# EAGLE design mlrs_lora_e5mini (EAGLE 9.6.2)
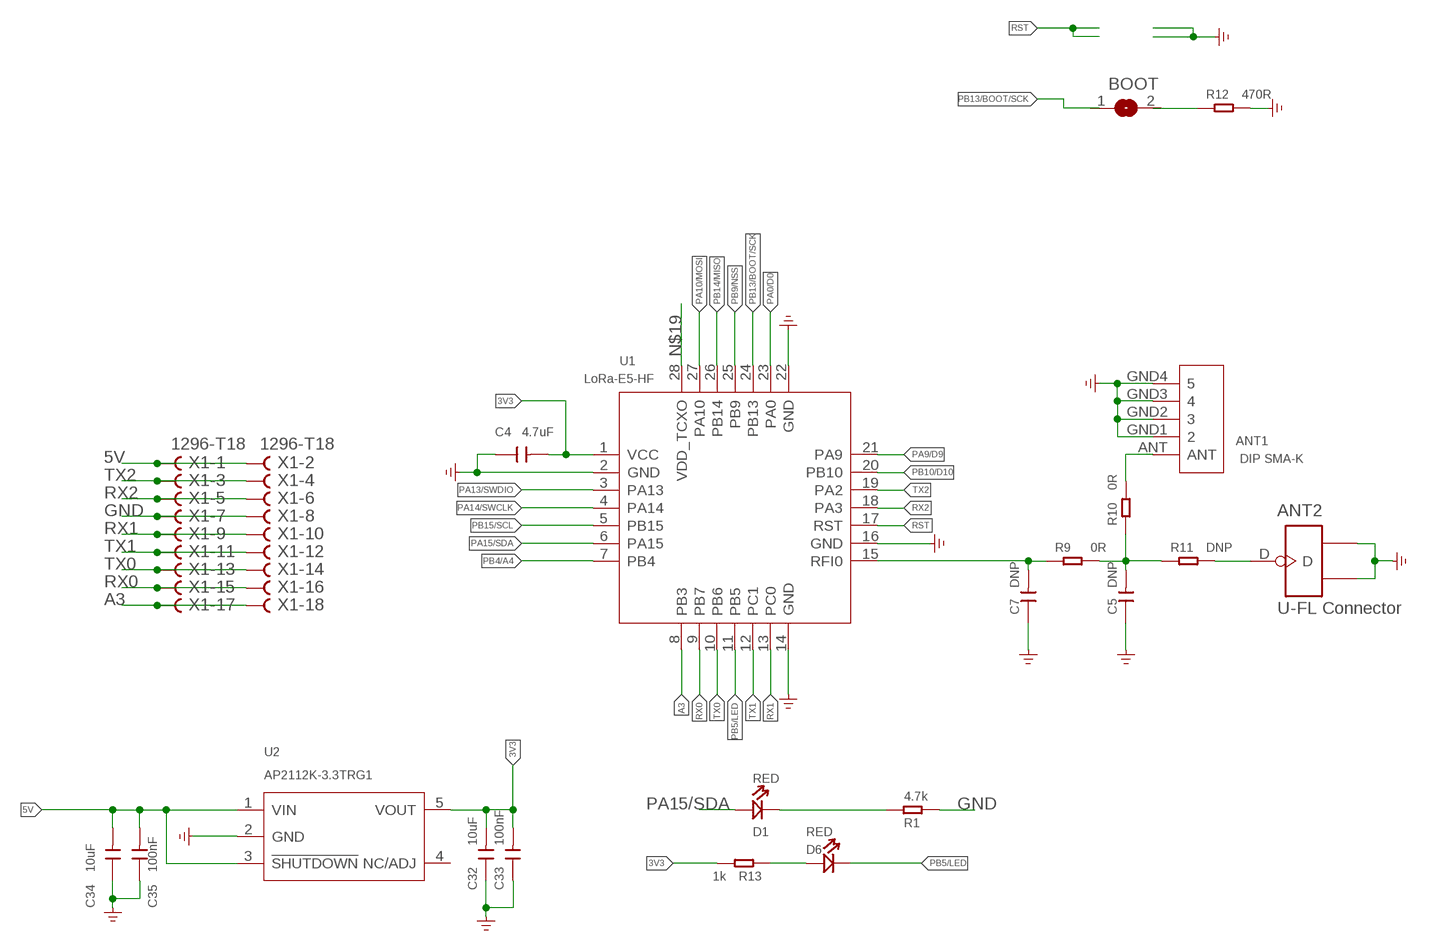
[diagram p0: schematic, sheet 1]

## Parts
ANT1  DIP SMA-K  ANTENNA-SMA-MCX-JE-320160125  [SMA5P-SMD-5.1-6.5X6.5X16.5MM]
ANT2  U-FL Connector  ANTENNA-U-FL-320110048  [U-FL3P-SMD-2.6X2.6X1.0MM]
BOOT  SJ  [SJ]
C4  4.7uF  CAP-0603  [C0603]
C5  DNP  CAP-0402  [C0402]
C7  DNP  CAP-0402  [C0402]
C32  10uF  CAP-0805  [C0805]
C33  100nF  CAP-0603  [C0603]
C34  10uF  CAP-0805  [C0805]
C35  100nF  CAP-0603  [C0603]
D1  RED  LED'0603'  [LED-0603]
D6  RED  LED'0603'  [LED-0603]
R1  4.7k  RES-0402  [R0402]
R9  0R  RES-0402  [R0402]
R10  0R  RES-0402  [R0402]
R11  DNP  RES-0402  [R0402]
R12  470R  RES-0402  [R0402]
R13  1k  RES-0402  [R0402]
U1  LoRa-E5-HF  MOUDLE_LORA_E5  [MOUDLE28P-1.25-12X12X2.5MM]
U2  AP2112K-3.3TRG1  PMIC-AP2127  [SOT-23-5]
X1  1296-T18  [1296-18]

## Nets
3V3: C4.2 C32.2 C33.2 R13.2 U1.1(VCC) U2.5(VOUT)
5V: C34.2 C35.2 U2.1(VIN) U2.3(!SHUTDOWN) X1.1 X1.2
A3: U1.8(PB3) X1.17 X1.18
GND: ANT1.GND1 ANT1.GND2 ANT1.GND3 ANT1.GND4 ANT2.GND1 ANT2.GND2 C4.1 C5.1 C7.1 C32.1 C33.1 C34.1 C35.1 R1.2 R12.2 U1.2(GND) U1.14(GND) U1.16(GND) U1.22(GND) U2.2(GND) X1.7 X1.8 ; supply symbol labelled GND_POWER
N$1: D1.- R1.1
N$4: ANT2.D R11.2
N$12: D6.+ R13.1
N$13: ANT1.ANT R10.2
N$19: U1.28(VDD_TCXO)
N$28: C5.2 R9.2 R10.1 R11.1
N$29: BOOT.2 R12.1
PA0/D0: U1.23(PA0)
PA9/D9: U1.21(PA9)
PA10/MOSI: U1.27(PA10)
PA13/SWDIO: U1.3(PA13)
PA14/SWCLK: U1.4(PA14)
PA15/SDA: D1.+ U1.6(PA15)
PB4/A4: U1.7(PB4)
PB5/LED: D6.- U1.11(PB5)
PB9/NSS: U1.25(PB9)
PB10/D10: U1.20(PB10)
PB13/BOOT/SCK: BOOT.1 U1.24(PB13)
PB14/MISO: U1.26(PB14)
PB15/SCL: U1.5(PB15)
RF: C7.2 R9.1 U1.15(RFI0)
RST: U1.17(RST)
RX0: U1.9(PB7) X1.15 X1.16
RX1: U1.13(PC0) X1.9 X1.10
RX2: U1.18(PA3) X1.5 X1.6
TX0: U1.10(PB6) X1.13 X1.14
TX1: U1.12(PC1) X1.11 X1.12
TX2: U1.19(PA2) X1.3 X1.4
Unconnected: U2.4(NC/ADJ)

## Library data of the parts
ANT1 = Connector-new:ANTENNA-SMA-MCX-JE
ANT2 = Connector-new:ANTENNA-U-FL
BOOT = jumper:SJ: SMD solder JUMPER
C4 C5 C7 C32-C35 = Discrete-new:CAP: Ceramic Capacitors
D1 D6 = Discrete-new:LED
R1 R9-R13 = Discrete-new:RES
U1 = moudle-new:MOUDLE_LORA_E5
U2 = PMIC:PMIC-AP2127
X1 = con-leotronics:1296-T18: 1.27mm SINGLE ROW FEMALE SOCKET Source: http://www.leotronics.co.uk/Conexcon/Data%20Sheets/sec.%20A/1296ing.pdf; OC_FARNELL: unknown; OC_NEWARK: unknown

## Board
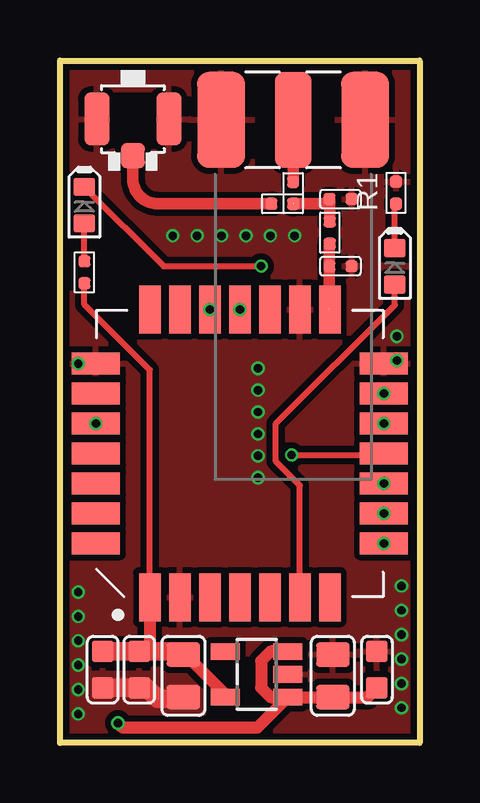
[diagram p1: board, top side]
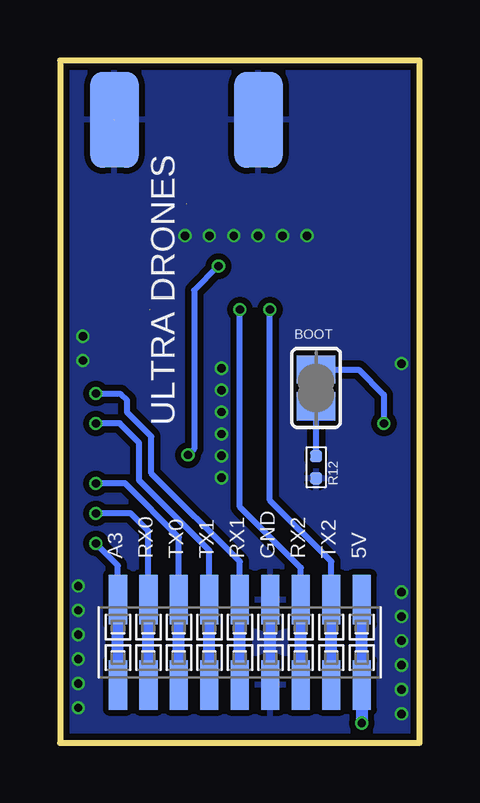
[diagram p2: board, bottom side, seen from below]

Size 14.99 x 28.45 mm. Coordinates in mm from the lower left corner, seen from the top.
Outline: 0,0 0,28.45 14.99,28.45 14.99,0 0,0
Copper layers (1*16): Top 0.035mm / dielectric 1.5mm / Bottom 0.035mm
Design rules "SeeedStudio_2layer_DRU_no_angle_20140221 *": minimum track width 10mil, minimum drill 10mil, track to track 10mil, track to pad 10mil, pad to pad 10mil, via to via 10mil, smd to smd 0mil, copper to edge 10mil, drill to drill 10mil, minimum pad ring 4mil, minimum via ring 4mil, stop-mask expansion 2mil, vias tented up to drill 25mil, thermal gap 10mil
tRestrict: area 8.1,24 to 11.4,27.7

### Footprints (pad centres in the part's own frame; a part is rotated, then mirrored left to right if it is on the bottom)
SMA5P-SMD-5.1-6.5X6.5X16.5MM = smd 4 x 1.524: ANT 0,0 | smd 4 x 2: GND1 0,3; GND2 0,-3 | smd 4 x 2 bottom: GND3 0,3; GND4 0,-3
U-FL3P-SMD-2.6X2.6X1.0MM = smd 1.05 x 1: D -1.524,0 | smd 2.2 x 1.05: GND1 0,1.5; GND2 0,-1.5
SJ = smd 1.168 x 1.6: 1 -0.762,0; 2 0.762,0
C0603 = smd 0.889 x 0.889: 1 -0.762,0; 2 0.762,0
C0402 = smd 0.5 x 0.5: 1 -0.463,0; 2 0.463,0
C0805 = smd 1.016 x 1.397: 1 -0.889,0; 2 0.889,0
LED-0603 = smd 0.762 x 0.889: + 0.762,0; - -0.762,0
R0402 = smd 0.5 x 0.5: 1 -0.463,0; 2 0.463,0
MOUDLE28P-1.25-12X12X2.5MM = smd 2 x 0.9: 1 -6,3.75; 2 -6,2.5; 3 -6,1.25; 4 -6,0; 5 -6,-1.25; 6 -6,-2.5; 7 -6,-3.75; 15 6,-3.75; 16 6,-2.5; 17 6,-1.25; 18 6,0; 19 6,1.25; 20 6,2.5; 21 6,3.75 | smd 0.9 x 2: 8 -3.75,-6; 9 -2.5,-6; 10 -1.25,-6; 11 0,-6; 12 1.25,-6; 13 2.5,-6; 14 3.75,-6; 22 3.75,6; 23 2.5,6; 24 1.25,6; 25 0,6; 26 -1.25,6; 27 -2.5,6; 28 -3.75,6
SOT-23-5 = smd 0.69 x 1.2: 1 -0.95,-1.3; 2 0,-1.3; 3 0.95,-1.3; 4 0.95,1.3; 5 -0.95,1.3
1296-18 = smd 0.76 x 2.05: 1 -5.08,-1.78; 2 -5.08,1.78; 3 -3.81,-1.78; 4 -3.81,1.78; 5 -2.54,-1.78; 6 -2.54,1.78; 7 -1.27,-1.78; 8 -1.27,1.78; 9 0,-1.78; 10 0,1.78; 11 1.27,-1.78; 12 1.27,1.78; 13 2.54,-1.78; 14 2.54,1.78; 15 3.81,-1.78; 16 3.81,1.78; 17 5.08,-1.78; 18 5.08,1.78

### Placement (x,y rotation side)
ANT1  9.72,25.97 270 top
ANT2  3.04,26.01 90 top
BOOT  4.32,14.8 270 bottom
C4  1.78,3.05 90 top
C5  11.68,22.67 180 top
C7  11.68,19.88 180 top
C32  5.14,2.79 90 top
C33  3.3,3.05 90 top
C34  11.37,2.79 270 top
C35  13.21,3.05 270 top
D1  13.95,19.87 270 top
D6  1.02,22.42 270 top
R1  14,22.93 90 top
R9  11.24,21.27 90 top
R10  9.72,22.92 90 top
R11  9.27,22.48 180 top
R12  4.32,11.49 270 bottom
R13  1.02,19.62 270 top
U1  7.49,12.06 90 top
U2  8.19,2.86 90 top
X1  7.49,4.19 180 bottom

### Tracks (layer width: path | path; a pad name or v marks a point on that pad's centre or on a via)
3V3
  Top 0.254: R13.2 1.02,18.28 3.74,15.55 U1.1
  Top 0.508: C33.2 3.56,3.81 3.74,4 U1.1 | C32.2 5.02,3.81 5.09,3.81 6.86,2.04 6.86,1.94 U2.5
  Top 0.762: C4.2 C33.2 | 3.56,3.81 5.02,3.81
5V  (via drill 0.35)
  Top 0.508: U2.1 C34.2 12.83,1.9 C35.2 | U2.3 8.78,3.81 8.38,3.41 8.38,2.3 8.78,1.91 U2.1 | U2.1 8.22,0.64 2.6,0.64 v2.41,0.83
  Bottom 0.508: v2.41,0.83 X1.2 X1.1
A3  (via drill 0.35)
  Bottom 0.254: X1.17 12.57,7.4 U1.8
  Bottom 0.508: X1.18 X1.17
  other vias: 13.49,8.31
GND  (via drill 0.35)  (1 unrouted)
  Top 0.254: ANT1.GND2 6.97,25.72
  Top 0.508: 5.08,1.84 C32.1
  Top 0.762: C4.1 C33.1 3.62,2.29 4.06,1.84 5.08,1.84
  Bottom 0.254: ANT1.GND2 6.97,25.72
  Bottom 0.508: X1.8 X1.7
  other vias: 0.76,15.81 0.76,1.21 0.76,2.22 0.76,3.24 0.76,4.25 0.76,5.27 0.76,6.29 14.22,1.46 14.22,2.48 14.22,3.49 14.22,4.51 14.22,5.52 14.22,6.54 9.78,21.15 8.76,21.15 7.75,21.15 6.73,21.15 5.71,21.15 4.7,21.15 14.03,15.94 14.03,16.95 8.26,11.05 8.26,11.96 8.26,12.88 8.26,13.79 8.26,14.71 8.26,15.62
  pour Top (rank 2): 0,28.45 0,0 14.99,0 14.99,28.45
  pour Bottom (isolate 0.254): 0,28.45 0,0 14.99,0 14.99,28.45
  pour Top (no thermals): -2,2.94 6.01,2.94 6.01,-1.62 -3,-1.62 -3,5.38 -2,4.38
N$1
  Top 0.254: 14,20.68 D1.- 13.95,22.42 R1.1
N$4
  Top 0.483: ANT2.D 3.04,23.51 arc90 4.07,22.48 R11.2
N$12
  Top 0.254: R13.1 D6.+
N$13
  Top 0.483: R10.2 9.72,25.34 9.65,25.4 9.65,25.91 ANT1.ANT
  Top 0.65: 9.78,25.91 ANT1.ANT
N$28  (1 unrouted)
  Top 0.483: R9.2 11.24,22.65 C5.2 11.03,22.48 R11.1
N$29
  Bottom 0.254: R12.1 BOOT.2
PA15/SDA
  Top 0.254: U1.6 9.99,10.73 8.99,11.73 8.99,13.31 13.95,18.26 D1.+
PB5/LED  (via drill 0.35)
  Top 0.254: v9.65,12 13.43,12 U1.11 | v8.38,19.88 4.32,19.88 D6.-
  Bottom 0.254: v8.38,19.88 9.4,18.86 9.4,12.26 v9.65,12
PB13/BOOT/SCK  (via drill 0.35)
  Bottom 0.254: BOOT.1 2.54,15.56 1.49,14.51 U1.24
  other vias: 1.49,13.31
RF  (1 unrouted)
  Top 0.483: R9.1 11.22,20.79 C7.2 11.22,18.09
RX0  (via drill 0.35)
  Bottom 0.254: X1.15 11.3,8.83 12.04,9.57 U1.9
  Bottom 0.508: X1.16 X1.15
  other vias: 13.49,9.56
RX1  (via drill 0.35)
  Bottom 0.254: X1.9 7.49,7.56 11.18,11.24 11.18,12.76 12.19,13.78 12.19,14.29 12.45,14.54 13.47,14.54 U1.13
  Bottom 0.508: X1.10 X1.9
  other vias: 13.49,14.56
RX2  (via drill 0.35)
  Bottom 0.254: X1.5 4.95,6.16 4.95,7.3 7.49,9.84 U1.18
  Bottom 0.508: X1.6 4.95,6.16
  other vias: 7.49,18.07
TX0  (via drill 0.35)
  Bottom 0.254: X1.13 10.03,8.57 12.28,10.82 U1.10
  Bottom 0.508: X1.14 X1.13
  other vias: 13.49,10.81
TX1  (via drill 0.35)
  Bottom 0.254: X1.11 8.76,8.02 11.68,10.94 11.68,12.51 12.49,13.32 U1.12
  Bottom 0.508: X1.12 X1.11
  other vias: 13.49,13.31
TX2  (via drill 0.35)
  Bottom 0.254: X1.3 3.68,7.56 6.24,10.12 U1.19
  Bottom 0.508: X1.4 X1.3
  other vias: 6.24,18.07

### Text on the board
bNames: ULTRA DRONES | 5V | TX2 | RX2 | GND | RX1 | TX1 | TX0 | RX0 | A3